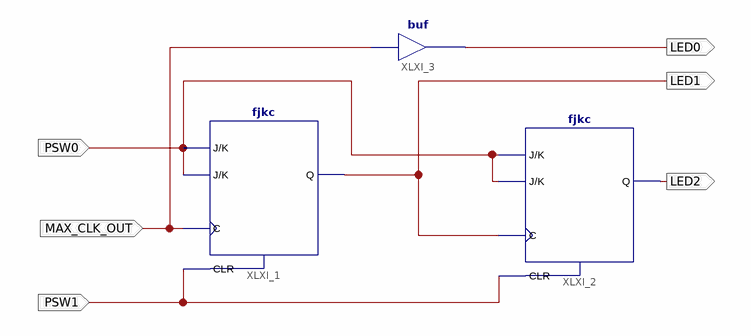
[diagram p0: schematic sheet 1]
// Xilinx ISE schematic lab6_5_jks.sch (spartan3) as structural Verilog: 3 symbols, 6 ports
module lab6_5_jks (
  input  PSW1,
  input  PSW0,
  input  MAX_CLK_OUT,
  output LED1,
  output LED2,
  output LED0
);

  fjkc XLXI_1 (.C(MAX_CLK_OUT), .CLR(PSW1), .J(PSW0), .K(PSW0), .Q(LED1));
  fjkc XLXI_2 (.C(LED1), .CLR(PSW1), .J(PSW0), .K(PSW0), .Q(LED2));
  buf XLXI_3 (LED0, MAX_CLK_OUT);
endmodule
